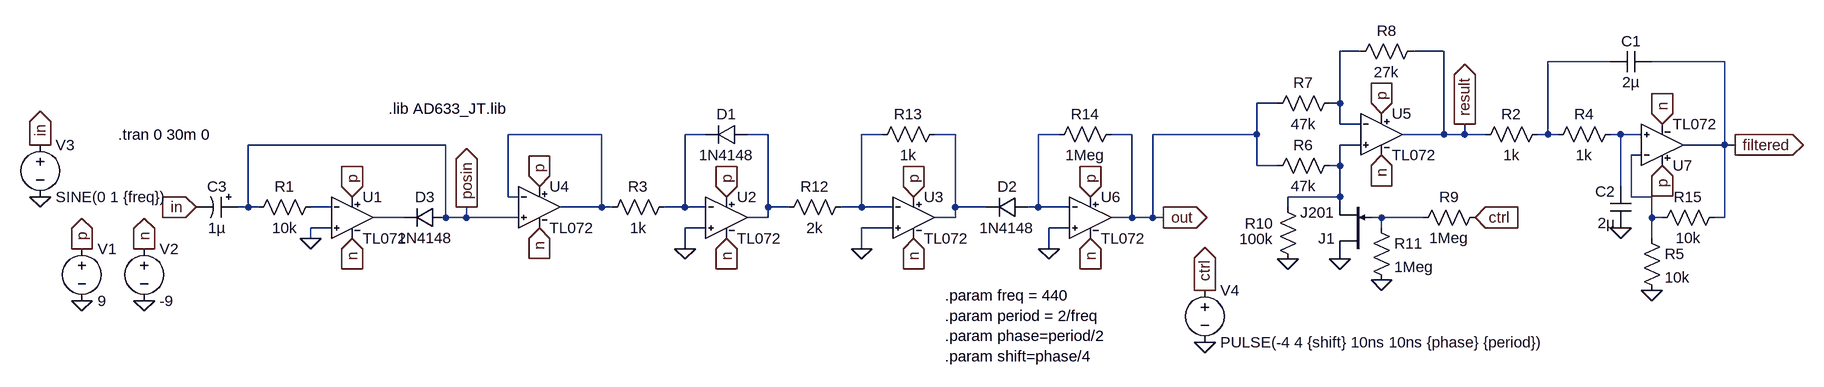
[diagram p0: schematic subwave-circuit.asc]
subwave-circuit.asc, the LTspice schematic file:
Version 4
SHEET 1 2172 680
WIRE 1472 16 1440 16
WIRE 1600 16 1552 16
WIRE 1856 32 1760 32
WIRE 2032 32 1920 32
WIRE 1344 96 1312 96
WIRE 1440 96 1440 16
WIRE 1440 96 1424 96
WIRE 1440 128 1440 96
WIRE 1472 128 1440 128
WIRE 304 144 160 144
WIRE 464 144 432 144
WIRE 560 144 528 144
WIRE 736 144 704 144
WIRE 848 144 816 144
WIRE 1008 144 976 144
WIRE 1120 144 1088 144
WIRE 1312 144 1312 96
WIRE 1312 144 1152 144
WIRE 1600 144 1600 16
WIRE 1600 144 1536 144
WIRE 1632 144 1632 128
WIRE 1632 144 1600 144
WIRE 1664 144 1632 144
WIRE 1760 144 1760 32
WIRE 1760 144 1744 144
WIRE 1776 144 1760 144
WIRE 1872 144 1856 144
WIRE 1904 144 1872 144
WIRE 64 160 -240 160
WIRE 1472 160 1440 160
WIRE 2032 160 2032 32
WIRE 2032 160 1968 160
WIRE 2048 160 2032 160
WIRE 1904 176 1888 176
WIRE 1312 192 1312 144
WIRE 1344 192 1312 192
WIRE 1440 192 1440 160
WIRE 1440 192 1424 192
WIRE 1872 224 1872 144
WIRE 160 240 160 144
WIRE 176 240 160 240
WIRE 1440 240 1440 192
WIRE 1440 240 1360 240
WIRE 1888 240 1888 176
WIRE 1920 240 1888 240
WIRE -240 256 -240 160
WIRE -240 256 -256 256
WIRE -224 256 -240 256
WIRE -112 256 -144 256
WIRE 304 256 304 144
WIRE 304 256 240 256
WIRE 320 256 304 256
WIRE 432 256 432 144
WIRE 432 256 400 256
WIRE 464 256 432 256
WIRE 560 256 560 144
WIRE 592 256 560 256
WIRE 704 256 704 144
WIRE 704 256 672 256
WIRE 752 256 704 256
WIRE 848 256 848 144
WIRE 896 256 848 256
WIRE 976 256 976 144
WIRE 976 256 960 256
WIRE 1024 256 976 256
WIRE 1360 256 1360 240
WIRE 0 272 -48 272
WIRE 64 272 64 160
WIRE 96 272 96 256
WIRE 96 272 64 272
WIRE 176 272 96 272
WIRE 560 272 560 256
WIRE 560 272 528 272
WIRE 848 272 848 256
WIRE 848 272 816 272
WIRE 1120 272 1120 144
WIRE 1120 272 1088 272
WIRE 1152 272 1152 144
WIRE 1152 272 1120 272
WIRE 1168 272 1152 272
WIRE 1504 272 1488 272
WIRE 1568 272 1504 272
WIRE 1920 272 1920 240
WIRE 1936 272 1920 272
WIRE 2032 272 2032 160
WIRE 2032 272 2016 272
WIRE -112 288 -144 288
WIRE 464 288 432 288
WIRE 752 288 704 288
WIRE 1024 288 992 288
WIRE 1504 288 1504 272
WIRE -144 304 -144 288
WIRE 1920 304 1920 272
WIRE 432 320 432 288
WIRE 704 320 704 288
WIRE 992 320 992 288
FLAG -400 400 0
FLAG -496 400 0
FLAG -496 320 p
IOPIN -496 320 Out
FLAG -400 320 n
IOPIN -400 320 Out
FLAG -80 240 p
IOPIN -80 240 In
FLAG -80 304 n
IOPIN -80 304 In
FLAG -560 240 0
FLAG -560 160 in
IOPIN -560 160 Out
FLAG -320 256 in
IOPIN -320 256 In
FLAG 1168 272 out
IOPIN 1168 272 Out
FLAG 96 256 posin
IOPIN 96 256 Out
FLAG 208 288 n
IOPIN 208 288 In
FLAG 208 224 p
IOPIN 208 224 In
FLAG 1440 336 0
FLAG 1632 128 result
IOPIN 1632 128 Out
FLAG 1648 272 ctrl
IOPIN 1648 272 In
FLAG 1504 176 n
IOPIN 1504 176 In
FLAG 1504 112 p
IOPIN 1504 112 In
FLAG 1232 464 0
FLAG 1232 384 ctrl
IOPIN 1232 384 Out
FLAG 1360 336 0
FLAG 1504 368 0
FLAG 432 320 0
FLAG 496 240 p
IOPIN 496 240 In
FLAG 496 304 n
IOPIN 496 304 In
FLAG 704 320 0
FLAG 784 240 p
IOPIN 784 240 In
FLAG 784 304 n
IOPIN 784 304 In
FLAG 992 320 0
FLAG 1056 240 p
IOPIN 1056 240 In
FLAG 1056 304 n
IOPIN 1056 304 In
FLAG -144 304 0
FLAG 2048 160 filtered
IOPIN 2048 160 Out
FLAG 1936 128 n
IOPIN 1936 128 In
FLAG 1936 192 p
IOPIN 1936 192 In
FLAG 1872 288 0
FLAG 1920 384 0
SYMBOL TL072 -80 208 R0
SYMATTR InstName U1
SYMBOL Voltage -496 304 R0
SYMATTR InstName V1
SYMATTR Value 9
SYMBOL Voltage -400 304 R0
SYMATTR InstName V2
SYMATTR Value -9
SYMBOL Voltage -560 144 R0
SYMATTR InstName V3
SYMATTR Value SINE(0 1 {freq})
SYMBOL Res 416 240 R90
WINDOW 0 0 56 VBottom 2
WINDOW 3 32 56 VTop 2
SYMATTR InstName R3
SYMATTR Value 1k
SYMBOL polcap -256 240 R90
WINDOW 0 0 32 VBottom 2
WINDOW 3 32 32 VTop 2
SYMATTR InstName C3
SYMATTR Value 1µ
SYMBOL diode 64 256 R90
WINDOW 0 0 32 VBottom 2
WINDOW 3 32 32 VTop 2
SYMATTR InstName D3
SYMATTR Value 1N4148
SYMBOL TL072 208 192 R0
SYMATTR InstName U4
SYMBOL Res -128 240 R90
WINDOW 0 0 56 VBottom 2
WINDOW 3 32 56 VTop 2
SYMATTR InstName R1
SYMATTR Value 10k
SYMBOL njf 1488 336 R180
SYMATTR InstName J1
SYMATTR Value J201
SYMBOL TL072 1504 80 R0
SYMATTR InstName U5
SYMBOL Res 1440 176 R90
WINDOW 0 0 56 VBottom 2
WINDOW 3 32 56 VTop 2
SYMATTR InstName R6
SYMATTR Value 47k
SYMBOL Res 1440 80 R90
WINDOW 0 0 56 VBottom 2
WINDOW 3 32 56 VTop 2
SYMATTR InstName R7
SYMATTR Value 47k
SYMBOL Res 1568 0 R90
WINDOW 0 0 56 VBottom 2
WINDOW 3 32 56 VTop 2
SYMATTR InstName R8
SYMATTR Value 27k
SYMBOL Res 1664 256 R90
WINDOW 0 0 56 VBottom 2
WINDOW 3 32 56 VTop 2
SYMATTR InstName R9
SYMATTR Value 1Meg
SYMBOL Voltage 1232 368 R0
SYMATTR InstName V4
SYMATTR Value PULSE(-4 4 {shift} 10ns 10ns {phase} {period})
SYMBOL Res 1344 240 R0
WINDOW 0 -50 41 Left 2
WINDOW 3 -59 65 Left 2
SYMATTR InstName R10
SYMATTR Value 100k
SYMBOL Res 1488 272 R0
SYMATTR InstName R11
SYMATTR Value 1Meg
SYMBOL TL072 496 208 R0
SYMATTR InstName U2
SYMBOL TL072 784 208 R0
SYMATTR InstName U3
SYMBOL TL072 1056 208 R0
SYMATTR InstName U6
SYMBOL diode 528 128 R90
WINDOW 0 0 32 VBottom 2
WINDOW 3 32 32 VTop 2
SYMATTR InstName D1
SYMATTR Value 1N4148
SYMBOL Res 688 240 R90
WINDOW 0 0 56 VBottom 2
WINDOW 3 32 56 VTop 2
SYMATTR InstName R12
SYMATTR Value 2k
SYMBOL Res 832 128 R90
WINDOW 0 0 56 VBottom 2
WINDOW 3 32 56 VTop 2
SYMATTR InstName R13
SYMATTR Value 1k
SYMBOL diode 960 240 R90
WINDOW 0 0 32 VBottom 2
WINDOW 3 32 32 VTop 2
SYMATTR InstName D2
SYMATTR Value 1N4148
SYMBOL Res 1104 128 R90
WINDOW 0 0 56 VBottom 2
WINDOW 3 32 56 VTop 2
SYMATTR InstName R14
SYMATTR Value 1Meg
SYMBOL TL072 1936 224 M180
SYMATTR InstName U7
SYMBOL Res 1760 128 R90
WINDOW 0 0 56 VBottom 2
WINDOW 3 32 56 VTop 2
SYMATTR InstName R2
SYMATTR Value 1k
SYMBOL Res 1872 128 R90
WINDOW 0 0 56 VBottom 2
WINDOW 3 32 56 VTop 2
SYMATTR InstName R4
SYMATTR Value 1k
SYMBOL Cap 1920 16 R90
WINDOW 0 0 32 VBottom 2
WINDOW 3 32 32 VTop 2
SYMATTR InstName C1
SYMATTR Value 2µ
SYMBOL Cap 1888 288 R180
WINDOW 0 24 56 Left 2
WINDOW 3 24 8 Left 2
SYMATTR InstName C2
SYMATTR Value 2µ
SYMBOL Res 1904 288 R0
SYMATTR InstName R5
SYMATTR Value 10k
SYMBOL Res 2032 256 R90
WINDOW 0 0 56 VBottom 2
WINDOW 3 32 56 VTop 2
SYMATTR InstName R15
SYMATTR Value 10k
TEXT -440 144 Left 2 !.tran 0 30m 0
TEXT -24 104 Left 2 !.lib AD633_JT.lib
TEXT 832 392 Left 2 !.param freq = 440\n.param period = 2/freq\n.param phase=period/2\n.param shift=phase/4

The netlist it stands for:
* subwave-circuit.asc
XU1 0 N012 p n N013 TL072  ; pins In+ In- V+ V- OUT
V1 p 0 9
V2 n 0 -9
V3 in 0 SINE(0 1 {freq})
R3 N004 N003 1k
C3 posin in 1µ
D3 posin N013 1N4148
XU4 posin N003 p n N003 TL072  ; pins In+ In- V+ V- OUT
R1 N012 posin 10k
J1 0 N014 N010 J201
XU5 N010 N001 p n result TL072  ; pins In+ In- V+ V- OUT
R6 N010 out 47k
R7 N001 out 47k
R8 result N001 27k
R9 ctrl N014 1Meg
V4 ctrl 0 PULSE(-4 4 {shift} 10ns 10ns {phase} {period})
R10 N010 0 100k
R11 N014 0 1Meg
XU2 0 N004 p n N005 TL072  ; pins In+ In- V+ V- OUT
XU3 0 N006 p n N007 TL072  ; pins In+ In- V+ V- OUT
XU6 0 N008 p n out TL072  ; pins In+ In- V+ V- OUT
D1 N005 N004 1N4148
R12 N006 N005 2k
R13 N007 N006 1k
D2 N008 N007 1N4148
R14 out N008 1Meg
XU7 N009 N011 p n filtered TL072  ; pins In+ In- V+ V- OUT
R2 N002 result 1k
R4 N009 N002 1k
C1 filtered N002 2µ
C2 0 N009 2µ
R5 N011 0 10k
R15 filtered N011 10k
.model D D
.lib standard.dio
.model NJF NJF
.model PJF PJF
.lib standard.jft
.tran 0 30m 0
.lib AD633_JT.lib
.param freq = 440
.param period = 2/freq
.param phase=period/2
.param shift=phase/4
.lib TL072.sub
.backanno
.end